# EAGLE design GPRSshield v1.4 (EAGLE 6.1)
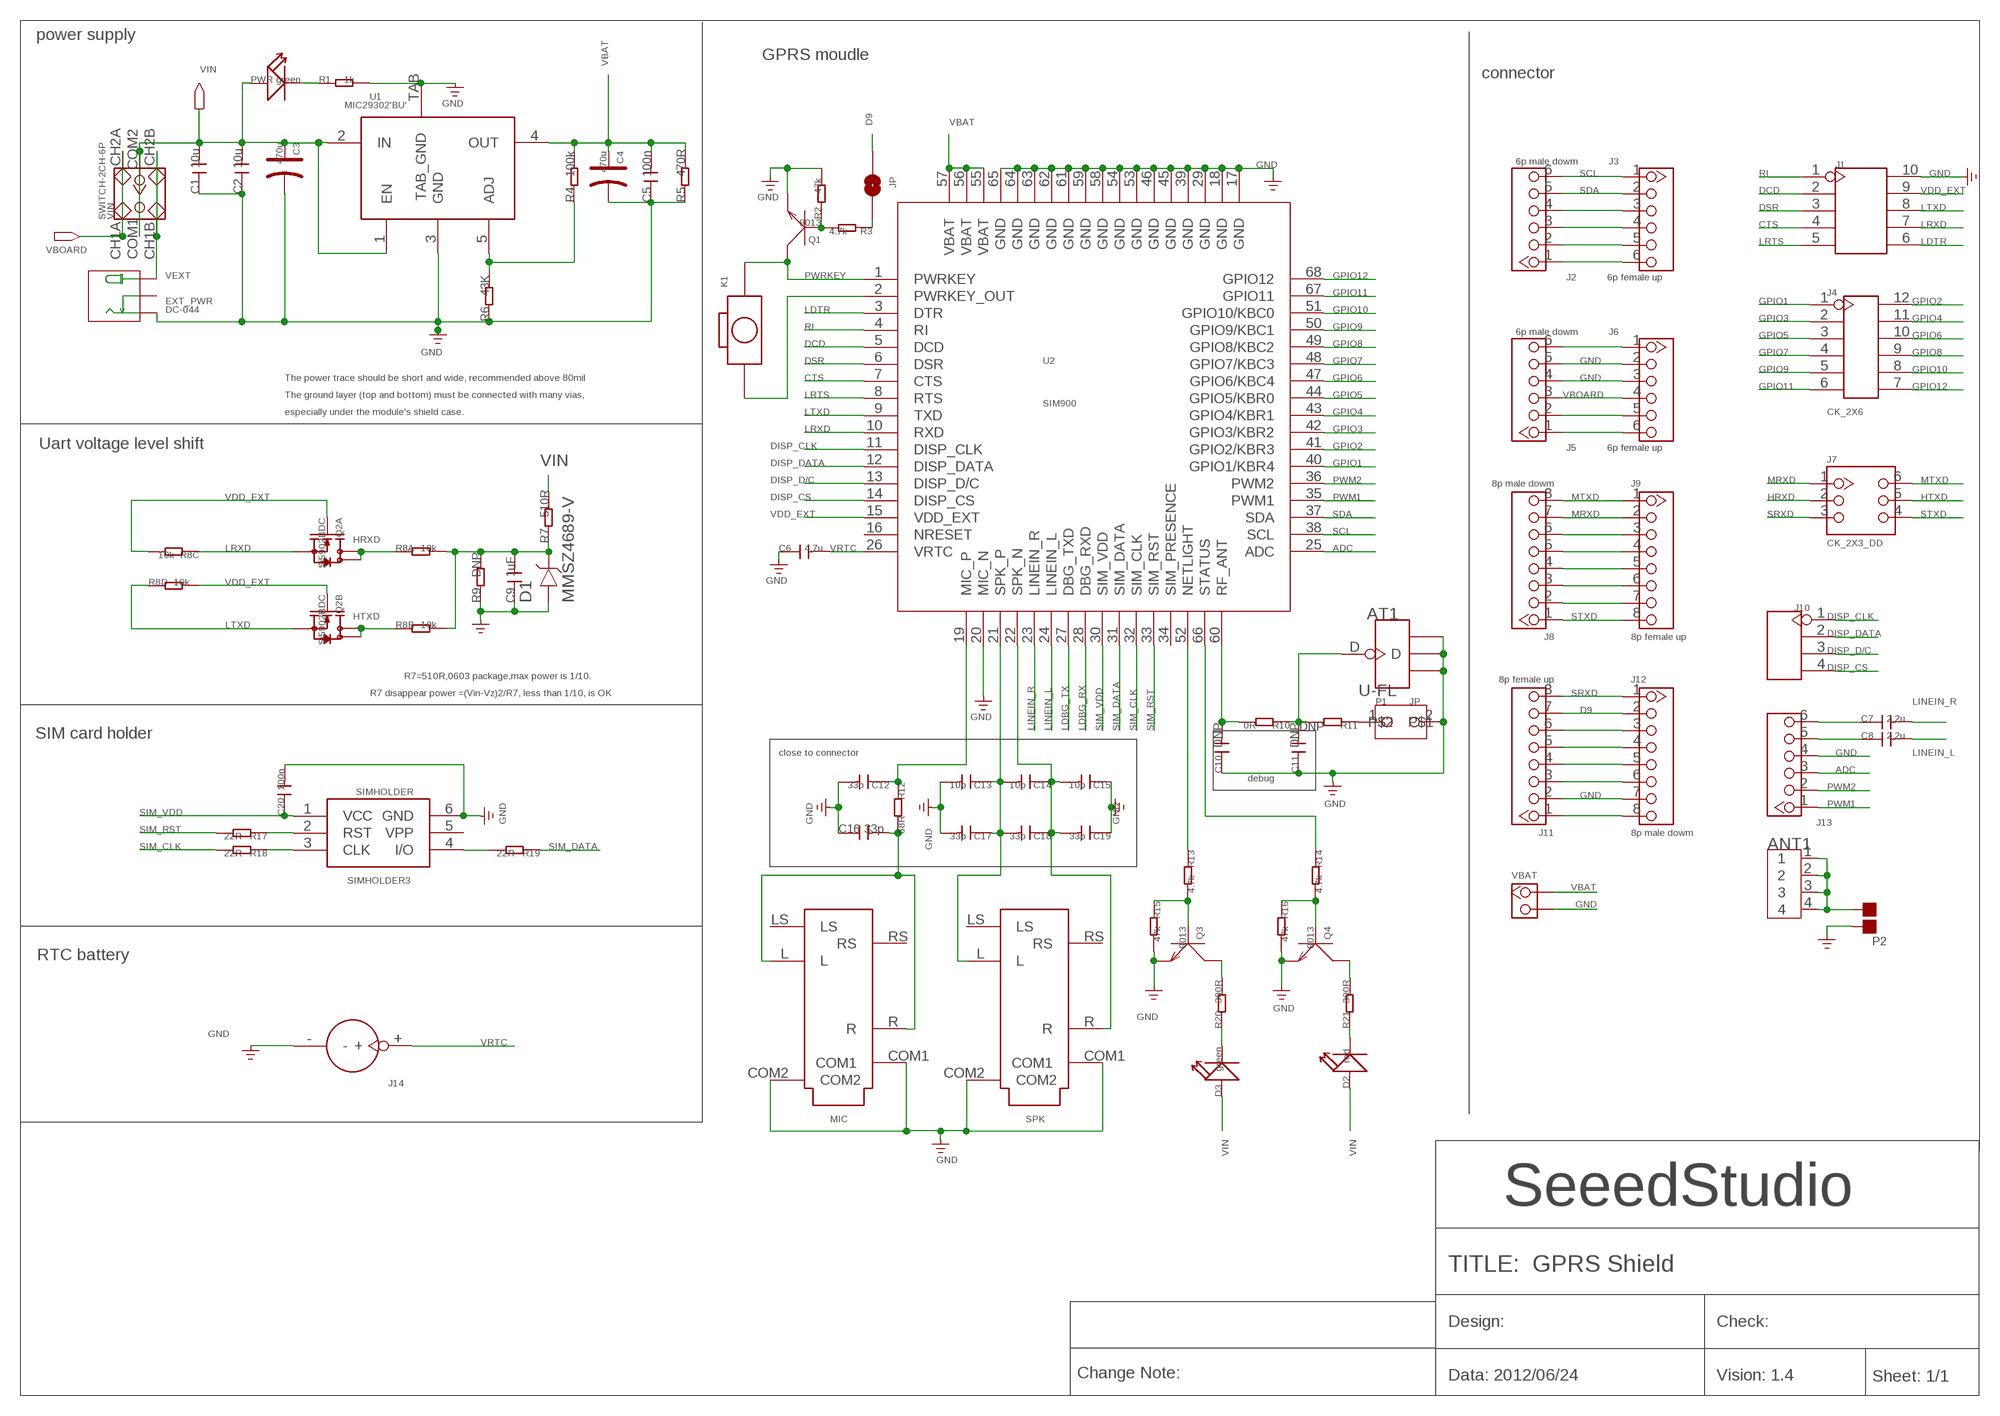
[diagram p0: schematic, sheet 1]

## Parts
ANT1  ANTENNA-SMA-IPX  [SMA-TO-IPX]
AT1  U-FL  ANTENNA-U-FL  [4P-U-FL]
C1  10u  C-0603  [0603]
C2  10u  C-0603  [0603]
C3  470u  006-CAP_AVX_D  [AVX_D]
C4  470u  006-CAP_AVX_D  [AVX_D]
C5  100n  C-0603  [0603]
C6  4.7u  C-0805  [0805]
C7  2.2u  C-0603  [0603]
C8  2.2u  C-0603  [0603]
C9  1uF  C-0603  [0603]
C10  DNP  C-0402  [0402]
C11  DNP  C-0402  [0402]
C12  33p  C-0603  [0603]
C13  10p  C-0402  [0402]
C14  10p  C-0402  [0402]
C15  10p  C-0402  [0402]
C16  33p  C-0603  [0603]
C17  33p  C-0402  [0402]
C18  33p  C-0402  [0402]
C19  33p  C-0402  [0402]
C20  100n  C-0603  [0603]
D1  MMSZ4689-V  D-VOL'MMSZ4681'  [SOD123-2.7X1.6]
D2  red  LED'0603'  [LED-0603]
D3  green  LED'0603'  [LED-0603]
EXT_PWR  DC-044  [DC-404]
J1  HEADER-2X5P-2.54  [2X5P-2.54]
J2  6p male dowm  HEADER_1X6  [CK_1X6]
J3  6p female up  HEADER_1X6  [CK_1X6]
J4  CK_2X6  [CK_2X6]
J5  6p male dowm  HEADER_1X6  [CK_1X6]
J6  6p female up  HEADER_1X6  [CK_1X6]
J7  CK_2X3_DD  [CK_2X3]
J8  8p male dowm  CK_1X8DD  [CK_1X8]
J9  8p female up  CK_1X8DD  [CK_1X8]
J10  HEADER-4P'2.54-90D-FEMALE'  [4P-2.54-90D-FEMALE]
J11  8p female up  CK_1X8DD  [CK_1X8]
J12  8p male dowm  CK_1X8DD  [CK_1X8]
J13  HEADER_1X6  [CK_1X6]
J14  HOLDER-BATTERY-2P-CR1220  [CR1220]
JP  PAD-SOLDERJUMPERNC  [2P-SMD-3.3X2]
K1  BOTTON_1_DP  [BTN_5.0_RST]
MIC  AUDIO-SMT  [3.5-SMD]
P1  JP  [JP]
P2  PAD-JUMPER-2P  [2P-SMD-1.78X1.27]
PWR  green  007-LED0603  [D0603]
Q1  9013  TRANSISTOR-NPN-SOT23  [SOT23]
Q2  Si5902BDC  010-DUAL-N-MOSFET_1206-8  [1206-8]
Q3  9013  TRANSISTOR-NPN-SOT23  [SOT23]
Q4  9013  TRANSISTOR-NPN-SOT23  [SOT23]
R1  1k  R-0603  [0603]
R2  47k  R-0603  [0603]
R3  4.7k  R-0603  [0603]
R4  100k  R-0603  [0603]
R5  470R  R-0603  [0603]
R6  43K  R-0603  [0603]
R7  510R  R-0603  [0603]
R8  10k  R-4R-1206  [1206-8-3.3X2.4]
R9  DNP  R-0603  [0603]
R10  0R  R-0402  [0402]
R11  DNP  R-0402  [0402]
R12  68R  R-0603  [0603]
R13  4.7k  R-0603  [0603]
R14  4.7k  R-0603  [0603]
R15  47k  R-0603  [0603]
R16  47k  R-0603  [0603]
R17  22R  R-0603  [0603]
R18  22R  R-0603  [0603]
R19  22R  R-0603  [0603]
R20  300R  R-0603  [0603]
R21  300R  R-0603  [0603]
SIMHOLDER  SIMHOLDER3  [SIMHOLDER3]
SPK  AUDIO-SMT  [3.5-SMD]
U1  MIC29302'BU'  [TO-263]
U2  SIM900  [SIM900]
VBAT  DNP  HEADER_1X2_2.54  [CK_1*2]
VIN  SWITCH-2CH-6P  [6P-2CH-2.54-7.6X3.0]

## Nets
ADC: J13.3 U2.25(ADC)
CTS: J1.4 U2.7(CTS)
D9: J11.7 J12.2 JP.1
DCD: J1.2 U2.5(DCD)
DISP_CLK: J10.1 U2.11(DISP_CLK)
DISP_CS: J10.4 U2.14(DISP_CS)
DISP_D/C: J10.3 U2.13(DISP_D/C)
DISP_DATA: J10.2 U2.12(DISP_DATA)
DSR: J1.3 U2.6(DSR)
GND: AT1.GND1 AT1.GND2 AT1.GND3 C1.1 C2.1 C3.- C4.- C5.1 C6.1 C9.1 C10.1 C11.1 C12.2 C13.2 C15.1 C16.1 C17.2 C19.1 C20.2 D1.1 EXT_PWR.- J1.10 J5.4 J5.5 J6.2 J6.3 J11.2 J12.7 J13.4 J14.- MIC.COM1 MIC.COM2 P1.2 P2.2 Q1.2(E) Q3.2(E) Q4.2(E) R1.2 R2.2 R5.1 R6.1 R9.1 R15.2 R16.2 SIMHOLDER.6(GND) SPK.COM1 SPK.COM2 U1.3(GND) U1.TAB(TAB_GND) U2.17(GND) U2.18(GND) U2.20(MIC_N) U2.29(GND) U2.39(GND) U2.45(GND) U2.46(GND) U2.53(GND) U2.54(GND) U2.58(GND) U2.59(GND) U2.61(GND) U2.62(GND) U2.63(GND) U2.64(GND) U2.65(GND) VBAT.2
GPIO1: J4.1 U2.40(GPIO1/KBR4)
GPIO2: J4.12 U2.41(GPIO2/KBR3)
GPIO3: J4.2 U2.42(GPIO3/KBR2)
GPIO4: J4.11 U2.43(GPIO4/KBR1)
GPIO5: J4.3 U2.44(GPIO5/KBR0)
GPIO6: J4.10 U2.47(GPIO6/KBC4)
GPIO7: J4.4 U2.48(GPIO7/KBC3)
GPIO8: J4.9 U2.49(GPIO8/KBC2)
GPIO9: J4.5 U2.50(GPIO9/KBC1)
GPIO10: J4.8 U2.51(GPIO10/KBC0)
GPIO11: J4.6 U2.67(GPIO11)
GPIO12: J4.7 U2.68(GPIO12)
HRXD: J7.2 Q2.7(A:D) Q2.8(A:D) R8.1
HTXD: J7.5 Q2.5(B:D) Q2.6(B:D) R8.2
LDBG_RX: U2.28(DBG_RXD)
LDBG_TX: U2.27(DBG_TXD)
LDTR: J1.6 U2.3(DTR)
LINEIN_L: C8.2 U2.24(LINEIN_L)
LINEIN_R: C7.2 U2.23(LINEIN_R)
LRTS: J1.5 U2.8(RTS)
LRXD: J1.7 Q2.1(A:S) R8.3 U2.10(RXD)
LTXD: J1.8 Q2.3(B:S) R8.4 U2.9(TXD)
MRXD: J7.1 J8.7 J9.2
MTXD: J7.6 J8.8 J9.1
N$1: C10.2 R10.2 U2.60(RF_ANT)
N$2: R4.1 R6.2 U1.5(ADJ)
N$3: Q3.3(C) R20.2
N$4: R19.2 SIMHOLDER.4(I/O)
N$5: R18.1 SIMHOLDER.3(CLK)
N$6: R17.1 SIMHOLDER.2(RST)
N$7: D3.- R20.1
N$8: Q3.1(B) R13.2 R15.1
N$9: C9.2 D1.2 R7.1 R8.7 R8.8 R9.2
N$10: R13.1 U2.52(NETLIGHT)
N$11: K1.P$1 U2.2(PWRKEY_OUT)
N$12: ANT1.1 ANT1.2 ANT1.3 ANT1.4 P2.1
N$13: C12.1 R12.1 U2.19(MIC_P)
N$14: JP.2 R3.1
N$15: C13.1 C14.2 C17.1 C18.2 SPK.L U2.21(SPK_P)
N$16: Q4.3(C) R21.2
N$17: D2.- R21.1
N$18: Q4.1(B) R14.2 R16.1
N$19: C14.1 C15.2 C18.1 C19.2 SPK.R U2.22(SPK_N)
N$20: R14.1 U2.66(STATUS)
N$21: AT1.D C11.2 R10.1 R11.2
N$22: P1.1 R11.1
N$23: C7.1 J13.6
N$24: J8.6 J9.3
N$25: J8.5 J9.4
N$26: J8.4 J9.5
N$27: J8.3 J9.6
N$28: J8.2 J9.7
N$29: C8.1 J13.5
N$30: C16.2 MIC.L MIC.R R12.2
N$32: J11.6 J12.3
N$33: J11.5 J12.4
N$34: J11.4 J12.5
N$35: J11.3 J12.6
N$36: Q1.1(B) R2.1 R3.2
N$37: J11.1 J12.8
N$41: J2.4 J3.3
N$42: J2.3 J3.4
N$43: J2.2 J3.5
N$44: J2.1 J3.6
N$45: J5.6 J6.1
N$49: J5.2 J6.5
N$50: J5.1 J6.6
N$53: PWR.- R1.1
PWM1: J13.1 U2.35(PWM1)
PWM2: J13.2 U2.36(PWM2)
PWRKEY: K1.P$2 Q1.3(C) U2.1(PWRKEY)
RI: J1.1 U2.4(RI)
SCL: J2.6 J3.1 U2.38(SCL)
SDA: J2.5 J3.2 U2.37(SDA)
SIM_CLK: R18.2 U2.32(SIM_CLK)
SIM_DATA: R19.1 U2.31(SIM_DATA)
SIM_RST: R17.2 U2.33(SIM_RST)
SIM_VDD: C20.1 SIMHOLDER.1(VCC) U2.30(SIM_VDD)
SRXD: J7.3 J11.8 J12.1
STXD: J7.4 J8.1 J9.8
VBAT: C4.+ C5.2 R4.2 R5.2 U1.4(OUT) U2.55(VBAT) U2.56(VBAT) U2.57(VBAT) VBAT.1
VBOARD: J5.3 J6.4 VIN.CH1A VIN.CH2A
VDD_EXT: J1.9 Q2.2(A:G) Q2.4(B:G) R8.5 R8.6 U2.15(VDD_EXT)
VEXT: EXT_PWR.+ VIN.CH1B VIN.CH2B
VIN: C1.2 C2.2 C3.+ D2.+ D3.+ PWR.+ R7.2 U1.1(EN) U1.2(IN) VIN.COM1 VIN.COM2
VRTC: C6.2 J14.+ U2.26(VRTC)
Unconnected: EXT_PWR.CDN MIC.LS MIC.RS SIMHOLDER.5(VPP) SPK.LS SPK.RS U2.16(NRESET) U2.34(SIM_PRESENCE)

## Notes on the sheet
- power supply
- GPRS moudle
- connector
- The power trace should be short and wide, recommended above 80mil
- The ground layer (top and bottom) must be connected with many vias,
- especially under the module's shield case.
- Uart voltage level shift
- R7=510R,0603 package,max power is 1/10.
- R7 disappear power =(Vin-Vz)2/R7, less than 1/10, is OK
- SIM card holder
- close to connector
- debug
- RTC battery
- SeeedStudio
- TITLE:  GPRS Shield
- Design: | Check:
- Change Note: | Data: 2012/06/24 | Vision: 1.4 | Sheet: 1/1

## Library data of the parts
ANT1 = Connector:ANTENNA-SMA-IPX
AT1 = Connector:ANTENNA-U-FL
C1 C2 C5-C20 = Discrete:C*: Ceramic Capacitors
C3 C4 = Discrete:006-CAP*: Electrolytic Capacitors,Tantalum Capacitors and Super Capacitors
D1 = template:D-VOL
D2 D3 = Discrete:LED*
EXT_PWR = Connector:DC-044
J1 = Connector:HEADER-2X5P
J2 J3 J5 J6 J13 = CONNECTER:HEADER_1X6
J4 = CONNECTER:CK_2X6
J7 = CONNECTER:CK_2X3
J8 J9 J11 J12 = CONNECTER:CK_1X8
J10 = Connector:HEADER-4P
J14 = Connector:HOLDER-BATTERY-2P
JP = Discrete:PAD-SOLDERJUMPER: Solder Jumper Standard SMD solder jumper. Used to automate production. Two varients : Normally Open and Normally Closed are the same, but have different paste layers. NC will have a large amount of paste and should jumper during reflow.
K1 = CPT_SMD:BOTTON_1
MIC SPK = Connector:AUDIO-SMT
P1 = mySeeed:JP
P2 = Discrete:PAD-JUMPER-2P; PARTNO: DNP
PWR = Discrete:007-LED*
Q1 Q3 Q4 = Discrete:TRANSISTOR-NPN*: NPN audion
Q2 = Discrete:010-DUAL-N-MOSFET*: Si5902BDC Si5904DC Si5908DC Si5920DC
R1-R7 R9-R21 = Discrete:R*
R8 = Discrete:R-4R*: Resistor Array
SIMHOLDER = SparkFun2:SIMHOLDER3
U1 = ICs_v54:MIC29302
U2 = ICs_v54:SIM900
VBAT = CONNECTER:HEADER_1X2
VIN = Discrete:SWITCH-2CH-6P

## Net classes
0 default: clearance 0.152 mm

## Board
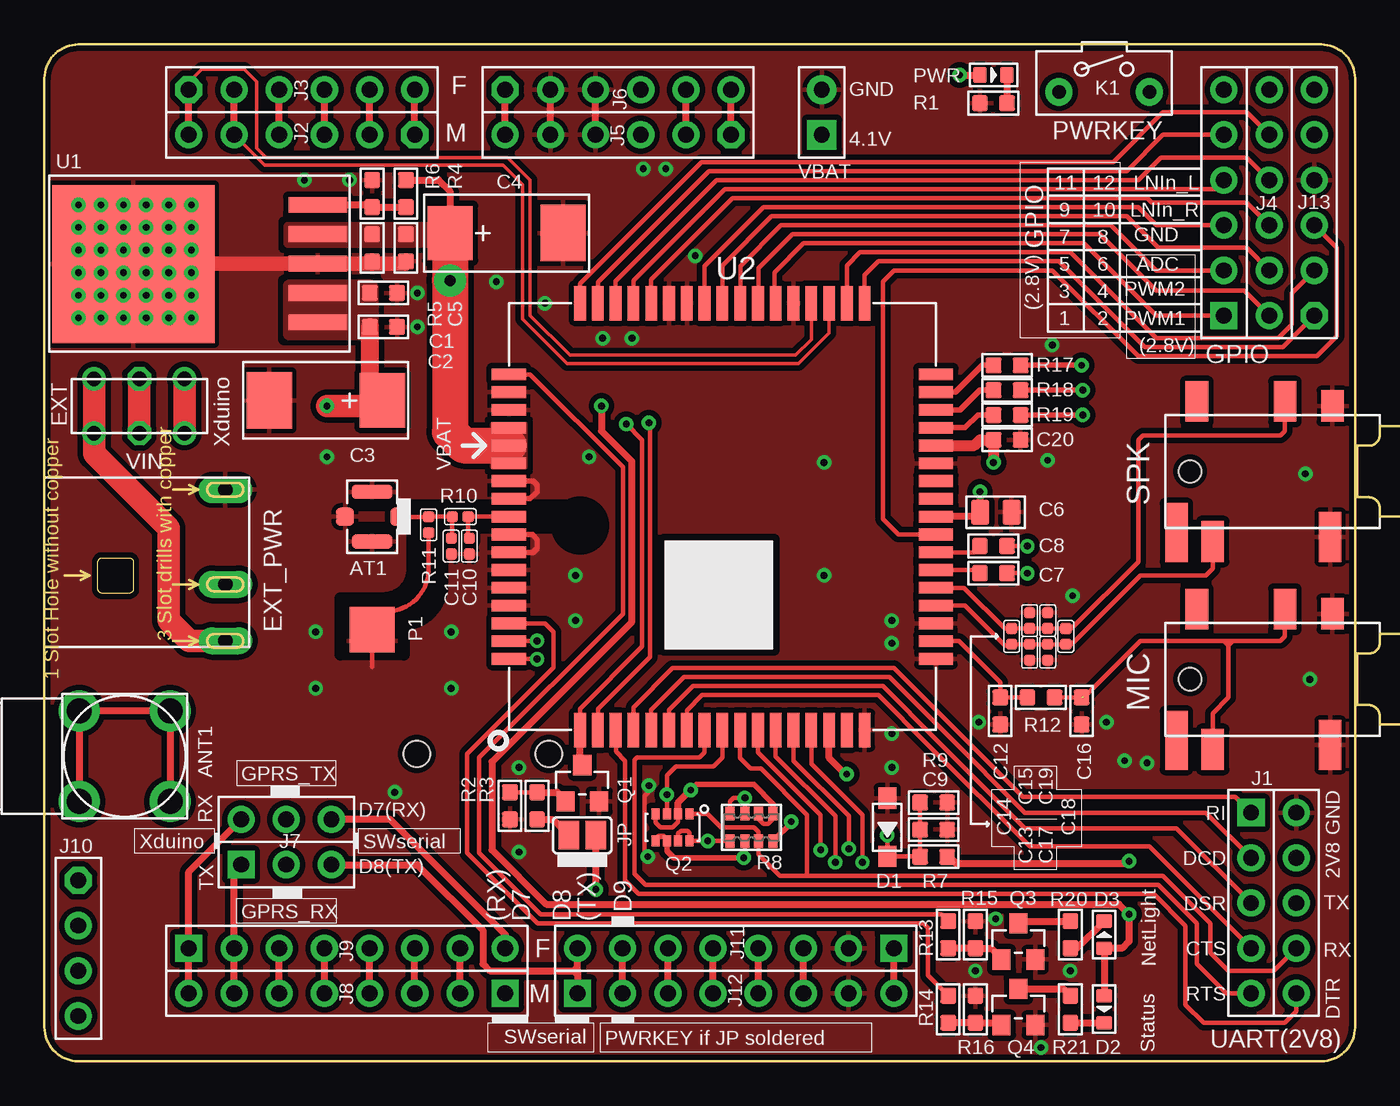
[diagram p1: board, top side]
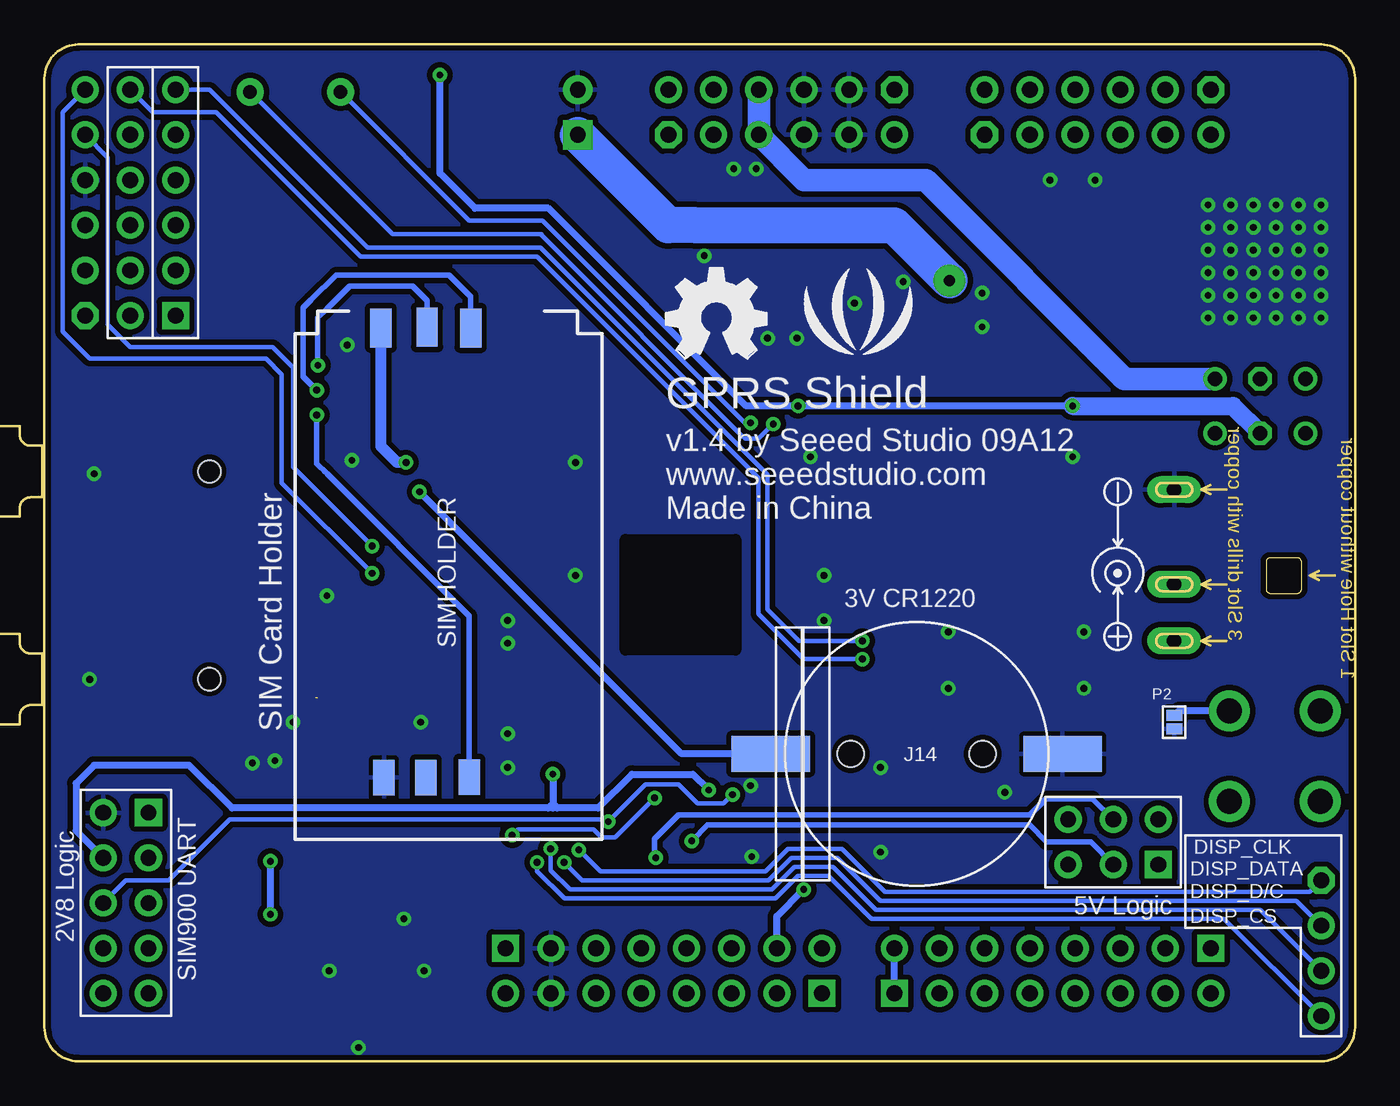
[diagram p2: board, bottom side, seen from below]

Size 73.66 x 57.15 mm. Coordinates in mm from the lower left corner, seen from the top.
Outline: 1.91,57.15 71.75,57.15 arc-90 73.66,55.24 73.66,1.91 arc-90 71.75,0 1.91,0 arc-90 0,1.91 0,55.24 arc-90 1.91,57.15
Copper layers (1*16): Top 0.035mm / dielectric 1.5mm / Bottom 0.035mm
Design rules: minimum track width 6mil, minimum drill 12mil, track to track 6mil, track to pad 6mil, pad to pad 6mil, via to via 6mil, smd to smd 0mil, copper to edge 10mil, drill to drill 10mil, minimum pad ring 10mil, minimum via ring 6mil, stop-mask expansion 2mil, vias tented up to drill 100mil, thermal gap 10mil
tRestrict: area 34.8,23.1 to 41,29.3; area 35.6,41.9 to 35.7,43.3; area 25.5,37 to 26.7,37.2; area 25.7,32 to 26.5,32.1; area 25.7,28.1 to 26.5,28.2; area 25.7,27.1 to 26.5,27.2; area 25.7,26 to 26.5,26.2; area 25.7,29.1 to 26.4,29.2; 11 lines
bRestrict: area 34.8,23.1 to 41,29.3

### Footprints (pad centres in the part's own frame; a part is rotated, then mirrored left to right if it is on the bottom)
SMA-TO-IPX = drill 1.4 pad 2.3: 1 -2.55,2.55; 2 2.55,2.55; 3 2.55,-2.55; 4 -2.55,-2.55
U-FL = smd 1.016 x 1.016: D -1.524,0; GND3 1.524,0 | smd 2.286 x 0.762: GND1 0,1.397; GND2 0,-1.397
0603 = smd 0.889 x 0.889: 1 -0.762,0; 2 0.762,0
AVX_D = smd 2.54 x 3.048: + -3.175,0 | smd 2.54 x 3.175: - 3.175,0
0805 = smd 1.016 x 1.397: 1 -0.889,0; 2 0.889,0
0603@1 = smd 0.889 x 0.889: 1 -0.762,0; 2 0.762,0
0402@1 = smd 0.635 x 0.635: 1 -0.445,0; 2 0.445,0
SOD123-2.7X1.6 = smd 1.2 x 1.02: 1 -1.635,0; 2 1.635,0
D0603 = smd 0.762 x 0.889: + -0.762,0; - 0.762,0
DC-404 = drill 0.813 pad 1.524 long: + 3.175,10.16; - -5.334,10.16; CDN 0,10.16
2X5P-2.54-LEADED = drill 0.889 pad 1.524 square: 1 -1.27,5.08 | drill 0.889 pad 1.524: 2 -1.27,2.54; 3 -1.27,0; 4 -1.27,-2.54; 5 -1.27,-5.08; 6 1.27,-5.08; 7 1.27,-2.54; 8 1.27,0; 9 1.27,2.54; 10 1.27,5.08
CK_1X6 = drill 0.889 pad 1.524 octagon: 1 0,6.35 | drill 0.889 pad 1.524: 2 0,3.81; 3 0,1.27; 4 0,-1.27; 5 0,-3.81; 6 0,-6.35
CK_2X6 = drill 0.889 pad 1.524 square: 1 -1.27,6.35 | drill 0.889 pad 1.524: 2 -1.27,3.81; 3 -1.27,1.27; 4 -1.27,-1.27; 5 -1.27,-3.81; 6 -1.27,-6.35; 7 1.27,-6.35; 8 1.27,-3.81; 9 1.27,-1.27; 10 1.27,1.27; 11 1.27,3.81; 12 1.27,6.35
CK_2X3 = drill 0.889 pad 1.524 square: 1 -1.27,2.54 | drill 0.889 pad 1.524: 2 -1.27,0; 3 -1.27,-2.54; 4 1.27,-2.54; 5 1.27,0; 6 1.27,2.54
CK_1X8 = drill 0.889 pad 1.524 square: 1 0,8.89 | drill 0.889 pad 1.524: 2 0,6.35; 3 0,3.81; 4 0,1.27; 5 0,-1.27; 6 0,-3.81; 7 0,-6.35; 8 0,-8.89
4P-2.54 = drill 0.889 pad 1.524 octagon: 1 0,3.81 | drill 0.889 pad 1.524: 2 0,1.27; 3 0,-1.27; 4 0,-3.81
CR1220 = smd 2 x 4.4: + 0,-8.2; - 0,8.2 | hole 1.5: 0,3.7; 0,-3.7
2P-SMD-3.3X2 = smd 1.168 x 1.6: 1 -0.762,0; 2 0.762,0
BTN_5.0_RST = drill 0.762 pad 1.524: P$1 0,2.54; P$2 0,-2.54
3.5-SMD = smd 1.27 x 1.778: COM1 -4.572,3.683 | smd 1.27 x 2.794: COM2 -4.699,-3.683 | smd 1.27 x 2.286: L -11.303,-3.937; R -7.239,3.937; RS -12.192,3.937 | smd 1.27 x 3.302: LS -13.335,-3.429 | hole 1.27: -12.573,0
JP = smd 1.27 x 2.54: 1 -0.635,0; 2 0.635,0
2P-SMD-1.78X1.27 = smd 0.889 x 0.61: 1 0,0.381; 2 0,-0.381
SOT23 = smd 1.016 x 1.143: 1 -0.95,-1.016; 2 0.95,-1.016; 3 0,1.016
1206-8 = smd 0.457 x 0.635: 1 -0.953,-0.762; 2 -0.318,-0.762; 3 0.318,-0.762; 4 0.953,-0.762; 5 0.953,0.762; 6 0.318,0.762; 7 -0.318,0.762; 8 -0.953,0.762
1206-8-3.3X2.4 = smd 0.508 x 0.762: 1 -1.206,-0.762; 2 -0.381,-0.762; 3 0.381,-0.762; 4 1.206,-0.762; 5 1.206,0.762; 6 0.381,0.762; 7 -0.381,0.762; 8 -1.206,0.762
0402 = smd 0.635 x 0.635: 1 -0.445,0; 2 0.445,0
SIMHOLDER3 = smd 2.2 x 1.2: 1 0.95,4.81; 2 0.91,7.41; 3 0.95,9.86 | smd 2 x 1.2: 4 26.2,9.78; 5 26.22,7.34; 6 26.22,4.98
TO-263 = smd 3.302 x 0.889: 1 3.302,-3.302; 2 3.302,-1.651; 3 3.302,0; 4 3.302,1.651; 5 3.302,3.302 | smd 9.12 x 8.89: TAB -7.071,-0.03
SIM900 = smd 1.93 x 0.66: 1 -12,8; 2 -12,7; 3 -12,6; 4 -12,5; 5 -12,4; 6 -12,3; 7 -12,2; 8 -12,1; 9 -12,0; 10 -12,-1; 11 -12,-2; 12 -12,-3; 13 -12,-4; 14 -12,-5; 15 -12,-6; 16 -12,-7; 17 -12,-8; 35 12,-8; 36 12,-7; 37 12,-6; 38 12,-5; 39 12,-4; 40 12,-3; 41 12,-2; 42 12,-1; 43 12,0; 44 12,1; 45 12,2; 46 12,3; 47 12,4; 48 12,5; 49 12,6; 50 12,7; 51 12,8 | smd 0.66 x 1.93: 18 -8,-12; 19 -7,-12; 20 -6,-12; 21 -5,-12; 22 -4,-12; 23 -3,-12; 24 -2,-12; 25 -1,-12; 26 0,-12; 27 1,-12; 28 2,-12; 29 3,-12; 30 4,-12; 31 5,-12; 32 6,-12; 33 7,-12; 34 8,-12; 52 8,12; 53 7,12; 54 6,12; 55 5,12; 56 4,12; 57 3,12; 58 2,12; 59 1,12; 60 0,12; 61 -1,12; 62 -2,12; 63 -3,12; 64 -4,12; 65 -5,12; 66 -6,12; 67 -7,12; 68 -8,12
CK_1*2 = drill 0.889 pad 1.651 square: 1 0,1.27 | drill 0.889 pad 1.651: 2 0,-1.27
6P-2CH-2.54-7.6X3.0 = drill 0.813 pad 1.27: CH1A -1.524,2.54; CH1B -1.524,-2.54; CH2A 1.524,2.54; CH2B 1.524,-2.54 | drill 0.813 pad 1.27 octagon: COM1 -1.524,0; COM2 1.524,0

### Placement (x,y rotation side)
ANT1  4.51,17.14 270 top
AT1  U-FL  [U-FL]  18.41,30.61 180 top
C1  19.05,43.18 180 top
C2  19.05,41.27 180 top
C3  15.81,37.15 180 top
C4  25.97,46.55 0 top
C5  20.32,45.72 90 top
C6  53.47,30.86 180 top
C7  2.2u  [0603@1]  53.34,27.43 180 top
C8  2.2u  [0603@1]  53.34,28.96 180 top
C9  49.97,13.02 180 top
C10  DNP  [0402@1]  23.88,28.96 90 top
C11  DNP  [0402@1]  22.86,28.96 90 top
C12  53.72,19.68 270 top
C13  10p  [0402@1]  55.37,22.99 270 top
C14  10p  [0402@1]  54.36,23.88 270 top
C15  10p  [0402@1]  55.37,24.77 270 top
C16  58.29,19.68 90 top
C17  33p  [0402@1]  56.39,22.99 270 top
C18  33p  [0402@1]  57.4,23.88 270 top
C19  33p  [0402@1]  56.39,24.77 270 top
C20  54.1,34.92 0 top
D1  47.37,13.14 270 top
D2  red  [D0603]  59.56,2.92 270 top
D3  green  [D0603]  59.56,7.11 90 top
EXT_PWR  0,26.8 270 top
J1  [2X5P-2.54-LEADED]  69.09,8.89 0 top
J2  14.46,52.07 270 top
J3  14.46,54.61 90 top
J4  67.56,48.26 180 bottom
J5  32.24,52.07 270 top
J6  32.24,54.61 90 top
J7  13.59,12.32 90 top
J8  17,3.81 270 top
J9  17,6.35 90 top
J10  [4P-2.54]  1.91,6.35 0 top
J11  38.85,6.35 270 top
J12  38.85,3.81 90 top
J13  71.37,48.26 180 top
J14  24.64,17.27 270 bottom
JP  30.23,12.7 180 top
K1  59.56,54.48 90 top
LOGO1  LOGO-SEEEDSTUDIO-SILK  [LOGO_SILK]  27.94,41.4 0 bottom
LOGO2  LOGO-OSHW-FILLX0200-NT  [OSHW_FILLX200_NOTEXT]  38.73,39.5 0 bottom
MIC  76.96,21.46 0 top
P1  18.41,24.26 270 top
P2  10.16,19.05 0 bottom
PWR  53.34,55.44 0 top
Q1  30.23,15.62 0 top
Q2  35.3,13.14 180 top
Q3  54.74,6.73 0 top
Q4  54.74,3.05 0 top
R1  1k  [0603@1]  53.34,53.85 180 top
R2  26.16,14.35 270 top
R3  27.69,14.35 90 top
R4  20.32,48.77 90 top
R5  18.41,45.72 90 top
R6  18.41,48.77 270 top
R7  49.97,11.49 0 top
R8  39.74,13.14 0 top
R9  49.97,14.54 180 top
R10  23.37,30.61 0 top
R11  21.59,30.15 90 top
R12  56.01,20.45 0 top
R13  50.8,7.11 270 top
R14  50.8,2.92 270 top
R15  52.32,7.11 90 top
R16  52.32,2.92 90 top
R17  54.1,39.12 180 top
R18  54.1,37.72 180 top
R19  54.1,36.32 0 top
R20  57.66,7.11 90 top
R21  57.66,2.92 90 top
SIMHOLDER  59.56,42.16 270 bottom
SPK  76.96,33.15 0 top
U1  12.06,44.83 0 top
U2  38.1,30.61 90 top
VBAT  43.69,53.34 180 top
VIN  5.33,36.83 270 top

### Tracks (layer width: path | path; a pad name or v marks a point on that pad's centre or on a via)
ADC
  Top 0.254: U2.25 47.99,29.61 47.12,30.48 47.12,43.81 47.75,44.45 56.64,44.45 61.47,39.62 71.5,39.62 72.64,40.77 72.64,45.72 J13.3
CTS
  Top 0.254: U2.7 36.1,19.72 36.96,20.57 46.86,20.57 49.66,17.78 55.37,12.06 62.1,12.06 J1.4
D9  (via drill 0.38 pad 0.81)
  Top 0.406: J12.2 J11.7 | v30.99,9.65 JP.1
  Bottom 0.406: J11.7 32.5,8.14 v30.99,9.65
DCD
  Top 0.254: U2.5 34.1,19.75 35.94,21.59 47.5,21.59 50.67,18.41 55.12,13.97 65.28,13.97 J1.2
DISP_CLK  (via drill 0.38 pad 0.81)
  Top 0.254: U2.11 40.1,17.37 43.62,13.84 v43.62,11.87
  Bottom 0.254: J10.1 2.54,9.53 26.42,9.53 28.83,11.94 31.88,11.94 33.15,10.67 42.42,10.67 v43.62,11.87
DISP_CS  (via drill 0.38 pad 0.81)
  Top 0.254: U2.14 43.1,16.72 45.97,13.84 v45.97,11.18
  Bottom 0.254: v45.97,11.18 45.97,10.68 44.44,9.14 32.58,9.14 31.3,10.41 29.59,10.41 27.18,8 7.37,8 J10.4
DISP_D/C  (via drill 0.38 pad 0.81)
  Top 0.254: U2.13 42.1,16.89 45.21,13.78 v45.21,11.94
  Bottom 0.254: v45.21,11.94 45.21,10.74 44.13,9.65 32.77,9.65 31.5,10.92 29.34,10.92 26.92,8.51 5.33,8.51 J10.3
DISP_DATA  (via drill 0.38 pad 0.81)
  Top 0.254: U2.12 41.1,17.13 44.45,13.78 v44.45,11.18
  Bottom 0.254: J10.2 3.3,9.02 26.67,9.02 29.08,11.43 31.69,11.43 32.96,10.16 43.43,10.16 v44.45,11.18
DSR
  Top 0.254: U2.6 35.1,19.73 36.45,21.08 47.12,21.08 50.16,18.03 55.12,13.08 63.63,13.08 J1.3
GND  (via drill 0.38 pad 0.81)
  Top 0.254: 18.41,22.15 P1.2 | v33.97,15.49 33.97,15.18 33.72,14.92 33.72,11.68 v33.91,11.49
  Top 0.305: U2.62 27.46,28.61 27.69,28.83 27.69,29.34 27.43,29.59 26.12,29.59 U2.61 | U2.58 27.46,32.61 27.69,32.38 27.69,32 27.3,31.62 26.12,31.62 U2.59
  Top 0.406: J5.4 J6.3 | J5.5 J6.2
  Top 0.813: v8.26,45.59 8.94,44.91 arc45 9.12,44.83 U1.3 20.26,44.83 20.32,44.9
  other vias: 47.62,24.77 57.78,26.16 60.71,16.89 71.12,21.46 47.62,16.51 70.87,33.02 56.64,40.26 8.26,41.78 8.26,43.05 8.26,44.32 8.26,46.86 8.26,48.13 6.99,48.13 5.71,48.13 4.45,48.13 3.17,48.13 1.91,48.13 1.91,46.86 1.91,45.59 1.91,44.32 1.91,43.05 1.91,41.78 4.45,46.86 4.45,45.59 4.45,44.32 4.45,43.05 4.45,41.78 3.17,46.86 3.17,45.59 3.17,44.32 3.17,43.05 3.17,41.78 5.71,46.86 5.71,45.59 5.71,44.32 5.71,43.05 5.71,41.78 6.99,46.86 6.99,45.59 6.99,44.32 6.99,43.05 6.99,41.78 56.39,33.78 61.98,16.76 22.86,20.95 26.67,11.75 53.47,8 57.66,5.08 52.32,5.08 56.01,0.76 19.68,15.11 20.95,43.18 20.95,41.27 25.4,43.81 28.13,42.61 17.14,49.53 14.61,49.53 33.02,40.64 31.37,40.64 36.58,45.28 43.81,33.66 43.81,27.3 33.66,50.16 34.92,50.16 47.62,18.41 26.67,16.51 30.61,33.97 29.84,24.77 29.84,27.3 22.86,24.13 15.88,33.97 15.24,24.13 15.24,20.95 47.62,23.5 52.51,19.05 59.69,19.05
  pour Bottom (isolate 0.305): -5.46,57.28 74.55,57.28 74.55,-0.51 -5.46,-0.51
  pour Top (isolate 0.305, rank 6): -5.46,57.28 74.55,57.28 74.55,-0.51 -5.46,-0.51
GPIO1
  Top 0.254: U2.40 41.02,42.69 41.02,44.32 42.67,45.97 58.42,45.97 62.48,41.91 J4.1
GPIO2
  Top 0.254: U2.41 40.13,42.64 40.13,44.58 42.04,46.48 59.31,46.48 62.48,43.31 67.44,43.31 J4.12
GPIO3
  Top 0.254: U2.42 39.12,42.62 39.12,44.7 41.4,46.99 59.94,46.99 62.48,44.45 J4.2
GPIO4
  Top 0.254: U2.43 38.1,44.73 40.87,47.5 60.83,47.5 62.61,45.72 67.56,45.72 J4.11
GPIO5
  Top 0.254: U2.44 37.08,42.62 37.08,44.69 40.4,48.01 61.47,48.01 62.48,46.99 J4.3
GPIO6
  Top 0.254: J4.10 67.56,48.26 62.23,48.26 61.98,48.51 38.67,48.51 34.1,43.94 U2.47
GPIO7
  Top 0.254: J4.4 65.79,49.02 38.24,49.02 33.1,43.88 U2.48
GPIO8
  Top 0.254: J4.9 67.56,50.8 62.74,50.8 61.47,49.53 37.77,49.53 32.1,43.86 U2.49 32.13,42.61
GPIO9
  Top 0.254: J4.5 62.87,52.07 60.83,50.04 37.34,50.04 31.1,43.8 U2.50
GPIO10
  Top 0.254: U2.51 30.1,43.72 36.92,50.55 60.07,50.55 62.87,53.34 67.56,53.34 J4.8
GPIO11  (via drill 0.38 pad 0.81)
  Top 0.254: U2.67 27.67,23.61 v27.69,23.62
  Bottom 0.254: v27.69,23.62 31.24,23.62 33.02,25.4 33.02,32.97 45.77,45.72 55.5,45.72 64.39,54.61 J4.6
GPIO12  (via drill 0.38 pad 0.81)
  Top 0.254: v27.69,22.61 U2.68
  Bottom 0.254: v27.69,22.61 31,22.61 33.53,25.13 33.53,32.77 45.97,45.21 55.88,45.21 64.01,53.34 67.56,53.34 J4.7
HRXD  (via drill 0.38 pad 0.81)
  Top 0.254: Q2.8 v37.27,12.38 R8.1 | Q2.8 36.25,12.44 | Q2.7 35.62,12.8 35.77,12.95 36.13,12.95 36.26,12.83 Q2.8
  Bottom 0.305: J7.2 14.86,12.32 17.34,12.32 18.29,13.27 36.39,13.27 v37.27,12.38
HTXD  (via drill 0.38 pad 0.81)
  Top 0.254: R8.2 39.36,11.48 v39.31,11.43
  Top 0.305: v39.31,11.43 35.37,11.43 34.98,11.82 Q2.6 34.98,12.45 34.8,12.64 34.54,12.64 34.34,12.44 Q2.5
  Bottom 0.305: J7.5 14.75,14.75 17.38,14.75 18.29,13.84 38.04,13.84 39.37,12.51 39.37,11.49 v39.31,11.43
LDTR
  Top 0.254: J1.6 70.36,2.79 69.72,2.16 65.15,2.16 64.14,3.17 64.14,7.62 62.36,9.4 33.4,9.4 32.64,10.16 32.64,16.89 32.13,17.4 32.13,18.58 U2.3
LINEIN_L
  Top 0.254: U2.24 52.23,28.61 C8.2
LINEIN_R
  Top 0.254: U2.23 52.4,27.61 C7.2
LRTS
  Top 0.254: J1.5 66.42,3.81 64.77,5.46 64.77,7.75 62.61,9.91 33.78,9.91 33.16,10.53 33.16,16.93 33.31,17.08 36.82,17.08 37.1,17.36 U2.8
LRXD
  Top 0.254: Q2.1 37.26,13.9 38.02,13.14 39.88,13.14 40.12,12.9 R8.3 40.12,11.63 41.34,10.41 42.86,10.41 | J1.7 69.09,5.08 66.55,5.08 65.53,6.1 65.53,7.75 62.87,10.41 42.86,10.41 | U2.10 39.1,17.03 39.69,16.45 40.26,16.45 42.86,13.84 42.86,10.41
LTXD  (via drill 0.38 pad 0.81)
  Top 0.254: U2.9 38.1,17.08 37.59,16.57 35.5,16.57 34.99,16.07 v34.99,14.99 34.99,13.91 Q2.3 | 40.96,12.45 40.95,12.44 R8.4 40.95,12.44
  Top 0.305: 40.95,12.44 | v41.97,13.47 41.97,13.4 R8.4
  Bottom 0.254: J1.8 69.09,10.16 66.67,10.16 63.25,13.59 42.09,13.59 v41.97,13.47 39.88,15.56 38.04,15.56 36.96,14.48 35.5,14.48 v34.99,14.99
MRXD
  Top 0.406: J8.7 J9.2 10.65,10.65 J7.1
MTXD
  Top 0.406: J8.8 J9.1 8.11,10.65 J7.6
N$1
  Top 0.254: U2.60 R10.2 23.81,29.46 C10.2
N$2
  Top 0.406: R4.1 R6.2 18.29,48.13 U1.5
N$3
  Top 0.406: R20.2 54.86,7.87 Q3.3
N$4  (via drill 0.38 pad 0.81)
  Top 0.305: v58.36,36.32 R19.2
  Bottom 0.305: 57.78,33.02 49.78,25.02 SIMHOLDER.4 | 57.78,33.02 57.91,33.15 | v58.36,36.32 58.36,33.59 57.78,33.02
N$5  (via drill 0.38 pad 0.81)
  Top 0.305: v58.36,37.72 R18.1
  Bottom 0.305: SIMHOLDER.3 49.7,42.97 50.93,44.2 57.28,44.2 58.67,42.8 59.12,42.35 59.12,38.48 v58.36,37.72
N$6  (via drill 0.38 pad 0.81)
  Top 0.305: v58.29,39.12 R17.1
  Bottom 0.305: SIMHOLDER.2 52.15,42.76 52.96,43.56 56.52,43.56 57.78,42.29 58.29,41.78 v58.29,39.12
N$7
  Top 0.406: R20.1 58.04,6.35 D3.-
N$8
  Top 0.406: R13.2 R15.1 53.21,6.35 Q3.1
N$9  (via drill 0.38 pad 0.81)
  Top 0.254: R8.7 39.36,14.79 v39.37,14.8 38.73,14.8 38.54,14.6 R8.8 | v47.37,12.7 D1.2 49.2,11.51 R7.1 C9.2 R9.2
  Bottom 0.254: v39.37,14.8 41.59,12.57 42.35,12.57 42.8,13.02 47.05,13.02 v47.37,12.7
N$10
  Top 0.254: U2.52 27.29,38.61 32.51,33.39 32.51,25.15 24.44,17.07 24.44,11.7 27.89,8.26 50.42,8.26 R13.1
N$11  (via drill 0.38 pad 0.81)
  Top 0.254: U2.2 31.11,18.62 31.11,19.81 34.04,22.73 34.04,35.43 34.04,35.81 v33.97,35.88
  Bottom 0.254: K1.P$1 49.78,47.24 45.66,47.24 34.29,35.88 v33.97,35.88
N$12
  Top 0.406: ANT1.3 ANT1.4 ANT1.1 ANT1.2
  Bottom 0.406: ANT1.1 9.9,19.7 P2.1
N$13
  Top 0.254: U2.19 51.4,23.61 53.72,21.28 C12.1 R12.1
N$14
  Top 0.406: R3.1 28.57,13.59 JP.2
N$15
  Top 0.254: U2.21 51.74,25.61 53.98,23.37 54.29,23.37 C14.2 C13.1 C17.1 C18.2 57.72,23.43 61.59,27.3 65.28,27.3 65.66,27.69 SPK.L
N$16
  Top 0.406: Q4.3 57.28,4.06 R21.2
N$17
  Top 0.406: R21.1 D2.-
N$18
  Top 0.406: R14.2 R16.1 53.72,2.16 Q4.1
N$19
  Top 0.254: U2.22 51.69,26.61 53.98,24.32 C14.1 C15.2 C19.2 C18.1 57.72,24.32 61.47,28.07 61.47,34.92 61.72,35.18 69.47,35.18 69.72,35.43 SPK.R
N$20
  Top 0.254: U2.66 28.12,24.61 28.6,24.13 28.6,22.12 23.76,17.28 23.76,11.71 27.73,7.75 49.4,7.75 49.66,7.49 49.66,4.83 R14.1
N$21
  Top 0.254: AT1.D arc91 19.95,30.59 R11.2 arc-91 21.6,30.61 R10.1 22.92,29.46 C11.2
N$22
  Top 0.254: R11.1 21.59,27.56 arc-90 19.05,25.27 18.8,25.27 arc90 P1.1
N$23  (via drill 0.38 pad 0.81)
  Top 0.254: C7.1 v55.24,27.43
  Bottom 0.254: J13.6 72.64,53.34 72.64,41.02 71.12,39.5 61.21,39.5 60.33,38.61 60.33,32.51 v55.24,27.43
N$24
  Top 0.406: J8.6 J9.3
N$25
  Top 0.406: J8.5 J9.4
N$26
  Top 0.406: J8.4 J9.5
N$27
  Top 0.406: J8.3 J9.6
N$28
  Top 0.406: J8.2 J9.7
N$29  (via drill 0.38 pad 0.81)
  Top 0.254: C8.1 v55.24,28.96
  Bottom 0.254: J13.5 70.1,50.8 70.1,41.4 68.83,40.13 60.83,40.13 59.69,38.99 59.69,33.4 v55.24,28.96
N$30  (1 unrouted)
  Top 0.254: 66.29,23.62 61.59,23.62 58.42,20.45 R12.2 | 66.29,23.62 66.55,23.62 | 66.55,23.62 66.55,23.37 | 66.55,23.62 66.8,23.62 | 66.29,23.62 66.55,23.37 | 66.55,23.37 66.55,20.45 65.66,19.56 MIC.L | 66.55,23.37 66.8,23.62 | 66.8,23.62 69.47,23.62 69.72,23.88 MIC.R
  Top 0.406: 58.42,20.45 58.42,20.32
N$32
  Top 0.406: J12.3 J11.6
N$33
  Top 0.406: J12.4 J11.5
N$34
  Top 0.406: J12.5 J11.4
N$35
  Top 0.406: J12.6 J11.3
N$36
  Top 0.254: R2.1 R3.2
  Top 0.406: R3.2 28.83,15.11 Q1.1
N$37
  Top 0.406: J12.8 J11.1
N$41
  Top 0.406: J2.4 J3.3
N$42
  Top 0.406: J2.3 J3.4
N$43
  Top 0.406: J2.2 J3.5
N$44
  Top 0.406: J2.1 J3.6
N$45
  Top 0.406: J5.6 J6.1
N$49
  Top 0.406: J5.2 J6.5
N$50
  Top 0.406: J5.1 J6.6
N$53
  Top 0.406: PWR.- 54.1,54.1 53.98,53.98 R1.1
PWM1
  Top 0.254: U2.35 46.1,44.2 46.86,44.96 57.02,44.96 61.85,40.13 69.6,40.13 J13.1
PWM2
  Top 0.254: U2.36 45.1,44.72 45.85,45.47 57.66,45.47 62.48,40.64 69.34,40.64 70.1,41.4 70.1,43.18 J13.2
PWRKEY  (via drill 0.38 pad 0.81)
  Top 0.254: U2.1 30.1,19.81 33.59,23.3 33.59,34.54 33.59,34.92 v32.7,35.81
  Top 0.406: U2.1 30.1,16.76 Q1.3
  Bottom 0.254: K1.P$2 54.1,46.48 45.72,46.48 45.72,46.42 34.42,35.12 34.29,34.99 33.53,34.99 v32.7,35.81
RI
  Top 0.254: U2.4 33.1,19.89 35.31,22.1 47.75,22.1 51.18,18.67 54.99,14.86 66.93,14.86 J1.1
SCL
  Top 0.203: U2.38 43.1,40.58 42.2,39.68 29.54,39.68 27.3,41.91 27.3,49.53 26.04,50.8 12.45,50.8 11.94,51.31 11.94,55.05 11.22,55.76 8.84,55.76 8.13,55.05 8.13,54.62 J3.1
  Top 0.406: J2.6 J3.1
SDA
  Top 0.203: U2.37 44.1,40.92 42.39,39.22 29.36,39.22 26.86,41.72 26.86,49.28 25.78,50.35 12.37,50.35 J2.5
  Top 0.406: J2.5 J3.2
SIM_CLK
  Top 0.305: U2.32 51.47,36.61 52.58,37.72 R18.2
SIM_DATA
  Top 0.305: U2.31 51.74,35.61 52.45,36.32 R19.1
SIM_RST
  Top 0.305: U2.33 51.2,37.61 52.7,39.12 R17.2
SIM_VDD  (via drill 0.38 pad 0.81)
  Top 0.61: U2.30 52.26,34.61 52.58,34.92 C20.1 v53.34,33.66
  Bottom 0.61: SIMHOLDER.1 54.75,34.56 53.85,33.66 v53.34,33.66
SRXD
  Top 0.305: 29.97,5.33 29.72,5.08 29.97,4.83
  Top 0.406: 29.96,6.34 J11.8 29.96,5.08 | J7.3 20.95,11.05 24.64,7.37 24.64,5.46 25.02,5.08 29.72,5.08 29.96,5.08 | 29.96,5.08 J12.1
STXD
  Top 0.406: J9.8 25.89,7.13 19.43,13.59 J7.4
  Bottom 0.406: J8.1 J9.8
VBAT  (via drill 0.64 pad 1.78)
  Top 0.406: R4.2 22.16,49.53 22.8,48.9 C4.+
  Top 2.032: C4.+ v22.8,43.88 22.8,35.37 23.56,34.61 U2.56
  Bottom 2.032: v22.8,43.88 25.91,46.99 25.97,46.99 26.04,46.99 37.02,46.99 38.61,46.99 VBAT.1
  pour Top (no thermals): 25.15,35.81 27.05,35.81 27.05,33.4 25.15,33.4
  pour Top (isolate 0.254, no thermals): 13.65,46.99 23.81,46.99 23.81,45.28 21.78,45.28 21.78,45.91 13.65,45.91
VBOARD
  Top 1.27: VIN.CH2A VIN.CH1A
  Bottom 1.27: VIN.CH1A 12.95,38.35 24.13,49.53 30.97,49.53 J5.3 J6.4
VDD_EXT  (via drill 0.38 pad 0.81)
  Top 0.254: Q2.4 34.34,13.43 34.64,13.14 35.3,13.14 35.62,13.45 Q2.2 | R8.6 40.12,13.63 40.41,13.34 40.67,13.34 40.96,13.62 R8.5 | Q2.2
  Top 0.305: v36.32,15.24 36.64,15.56 39.87,15.56 40.95,14.47 R8.5
  Top 0.406: U2.15 44.1,17.05 45.02,16.13 v45.09,16.13 | Q2.2 35.62,14.53 v36.32,15.24
  Bottom 0.406: J1.9 71.88,12.95 71.88,15.62 70.87,16.64 65.53,16.64 63.12,14.22 45.34,14.22 | 44.83,14.22 42.55,14.22 40.64,16.13 37.21,16.13 v36.32,15.24 | 44.83,14.22 45.09,14.22 | 45.09,14.22 45.34,14.22 | v45.09,16.13 45.09,14.22 | 45.34,14.22 45.09,14.48 44.83,14.22
VEXT
  Top 1.27: EXT_PWR.+ 8.13,23.62 6.99,24.77 6.99,29.97 2.79,34.16 VIN.CH2B VIN.CH1B
VIN  (via drill 0.38 pad 0.81)
  Top 0.406: v51.44,55.44 PWR.+ | v31.3,36.83 31.3,35.43 33.02,33.72 33.02,24.7 25.15,16.83 25.15,11.87 28.19,8.83 60.39,8.83 v60.96,8.26 60.96,6.73 60.58,6.35 D3.+ D2.+ | R7.2 50.86,11.49 51.24,11.11 60.83,11.11 v60.96,11.24
  Top 1.016: C2.2 18.29,37.85 C3.+
  Top 1.27: VIN.COM1 VIN.COM2 | 19.05,37.21 C3.+ | 18.92,37.08 C3.+ | v15.88,36.83 18.67,36.83 C3.+
  Bottom 0.406: v60.96,8.26 v60.96,11.24 | v51.44,55.44 51.44,49.91 49.47,47.94 45.34,47.94 34.23,36.83 v31.3,36.83 v15.88,36.83
  Bottom 1.016: v15.88,36.83 6.86,36.83 VIN.COM2
  pour Top (isolate 0.254, no thermals): 18.29,40.64 13.78,40.64 arc-90 13.53,40.89 13.53,43.56 arc-90 13.78,43.81 18.29,43.81 arc-90 18.67,43.43 18.67,41.02 arc-90
VRTC  (via drill 0.38 pad 0.81)
  Top 0.406: v52.58,32 C6.2 52.32,30.61 U2.26
  Bottom 0.406: J14.+ 37.85,17.27 v52.58,32

### Text on the board
tPlace: F | GND | M | PWRKEY | 4.1V | 11 | 12 | LNIn_L | GPIO | 9 | 10 | LNIn_R | 7 | 8 | GND | (2.8V) | 5 | 6 | ADC | 3 | 4 | PWM2 | 1 | 2 | PWM1 | (2.8V) | GPIO | EXT | Xduino | VBAT | GPRS_TX | RX | GND | D7(RX) | RI | Xduino | SWserial | DCD | 2V8 | TX | D8(TX) | DSR | TX | GPRS_RX | (RX) | D7 | D8 | (TX) | D9 | F | CTS | RX | NetLight | DTR | M | RTS | SWserial | UART(2V8) | PWRKEY if JP soldered | Status
bPlace: GPRS Shield | v1.4 by Seeed Studio 09A12 | www.seeedstudio.com | Made in China | 3V CR1220 | SIMHOLDER | SIM Card Holder | SIM900 UART | 2V8 Logic | DISP_CLK | DISP_DATA | DISP_D/C | 5V Logic | DISP_CS
tNames: J4 | J13